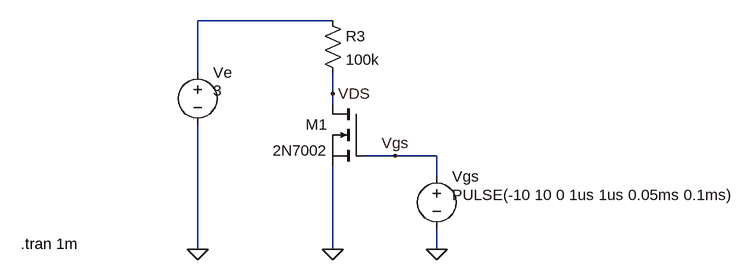
[diagram p0: schematic etude du transistor en commutation.asc]
etude du transistor en commutation.asc, the LTspice schematic file:
Version 4
SHEET 1 880 680
WIRE -48 -400 -256 -400
WIRE -256 -320 -256 -400
WIRE -48 -288 -48 -320
WIRE -48 -272 -48 -288
WIRE 48 -192 0 -192
WIRE 112 -192 48 -192
WIRE 112 -160 112 -192
WIRE -256 -48 -256 -240
WIRE -48 -48 -48 -176
WIRE 112 -48 112 -80
FLAG 112 -48 0
FLAG -48 -48 0
FLAG -256 -48 0
FLAG 48 -192 Vgs
FLAG -48 -288 VDS
SYMBOL voltage 112 -176 R0
WINDOW 3 24 44 Left 2
WINDOW 123 0 0 Left 2
WINDOW 39 0 0 Left 2
SYMATTR Value PULSE(-10 10 0 1us 1us 0.05ms 0.1ms)
SYMATTR InstName Vgs
SYMBOL nmos 0 -272 M0
SYMATTR InstName M1
SYMATTR Value 2N7002
SYMBOL res -64 -416 R0
SYMATTR InstName R3
SYMATTR Value 100k
SYMBOL voltage -256 -336 R0
WINDOW 123 0 0 Left 2
WINDOW 39 0 0 Left 2
WINDOW 3 24 44 Left 2
SYMATTR InstName Ve
SYMATTR Value 3
TEXT -528 -56 Left 2 !.tran 1m

The netlist it stands for:
* etude du transistor en commutation.asc
Vgs Vgs 0 PULSE(-10 10 0 1us 1us 0.05ms 0.1ms)
M1 VDS Vgs 0 0 2N7002
R3 N001 VDS 100k
Ve N001 0 3
.model NMOS NMOS
.model PMOS PMOS
.lib standard.mos
.tran 1m
.backanno
.end

* Results of the author's LTspice run, read from the files saved beside the schematic
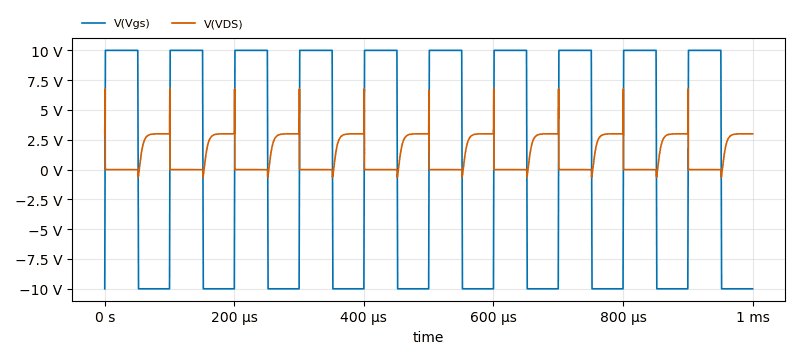
[diagram p1: Transient Analysis of etude du transistor en commutation.asc, plotted from the saved traces]
* Transient Analysis, 1 run:
*   V(Vgs): min -10 V, max 10 V, average 200 mV, rms 9.934 V, last -10 V
*   V(VDS): min -627.8 mV, max 6.78 V, average 1.285 V, rms 1.938 V, last 3 V